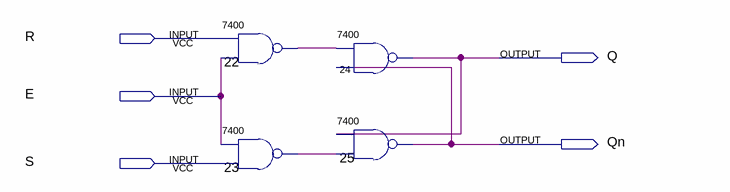
[diagram p0: schematic sheet]
// Quartus schematic Problem4.bdf as structural Verilog: 4 symbols, 5 pins
module Problem4 (
  input  R,
  input  E,
  input  S,
  output Q,
  output Qn
);

  wire n22_1, n23_1;

  \7400  u_22 (.\3 (E), .\2 (R), .\1 (n22_1));
  \7400  u_23 (.\3 (S), .\2 (E), .\1 (n23_1));
  \7400  u_24 (.\3 (Qn), .\2 (n22_1), .\1 (Q));
  \7400  u_25 (.\3 (n23_1), .\2 (Q), .\1 (Qn));
endmodule
